# Altium schematic sheet XCZU_LED_STATUS.SchDoc
size A3; SheetNumber: 1; SheetTotal: 8
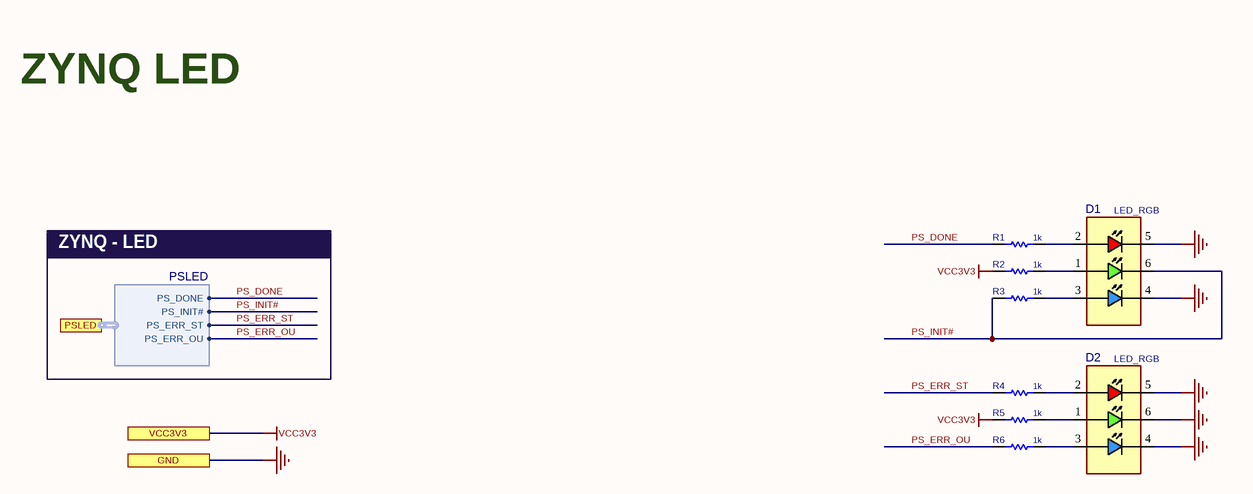
[diagram p0: XCZU_LED_STATUS.SchDoc]

## Parts
D1  LED_RGB  [LED1615RGB]
D2  LED_RGB  [LED1615RGB]
R1  1k  [R0402]
R2  1k  [R0402]
R3  1k  [R0402]
R4  1k  [R0402]
R5  1k  [R0402]
R6  1k  [R0402]

## Ports
GND, PSLED (harness PSLED), VCC3V3

## Harnesses
PSLED: PS_DONE, PS_INIT#, PS_ERR_ST, PS_ERR_OU

## Nets
GND: D1.4(K_BLU) D1.5(K_RED) D2.4(K_BLU) D2.5(K_RED) D2.6(K_GRN) ; port GND
VCC3V3: R2.1 R5.1 ; port VCC3V3
PS_DONE: R1.1 ; port PSLED.PS_DONE
PS_ERR_OU: R6.1 ; port PSLED.PS_ERR_OU
PS_ERR_ST: R4.1 ; port PSLED.PS_ERR_ST
PS_INIT#: D1.6(K_GRN) R3.1 ; port PSLED.PS_INIT#
NetD1_1: D1.1(A_GRN) R2.2
NetD1_2: D1.2(A_RED) R1.2
NetD1_3: D1.3(A_BLU) R3.2
NetD2_1: D2.1(A_GRN) R5.2
NetD2_2: D2.2(A_RED) R4.2
NetD2_3: D2.3(A_BLU) R6.2

## Notes on the sheet
- ZYNQ LED
- ZYNQ - LED

## Library data of the parts
D1 D2 = LED_SMD_RGB_E6C1615: LED, SMD, RGB; MANF_P#: E6C1615RGBC3UDA; MANF: EKINGLUX; DESC: DESCRIPTION; ASSEMBLY: ASSEMBLY; PRICE: PRICE; VALUE: LED_RGB
R1-R6 = RES_SMD: RESISTOR, SMD; PARAM: -W; DESC: DESCRIPTION; DIST#: MOUSER; PARAM2: 1%; MANF_P#: -; MANF: -; ASSEMBLY: ASSEMBLY; PRICE: 100= 0.5$; VALUE: 1k